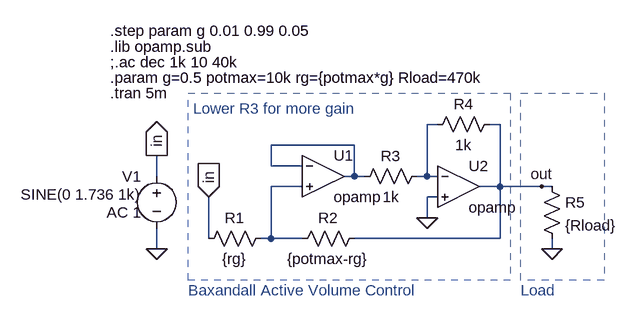
[diagram p0: schematic volume_control.asc]
volume_control.asc, the LTspice schematic file:
Version 4
SHEET 1 1156 680
WIRE 448 -80 432 -80
WIRE 544 -80 528 -80
WIRE 320 -48 192 -48
WIRE 192 -16 192 -48
WIRE 240 -16 192 -16
WIRE 16 0 16 -32
WIRE 320 0 320 -48
WIRE 320 0 304 0
WIRE 336 0 320 0
WIRE 432 0 432 -80
WIRE 432 0 416 0
WIRE 448 0 432 0
WIRE 240 16 192 16
WIRE 544 16 544 -80
WIRE 544 16 512 16
WIRE 608 16 544 16
WIRE 624 16 608 16
WIRE 448 32 432 32
WIRE 432 64 432 32
WIRE 96 96 96 32
WIRE 192 96 192 16
WIRE 192 96 176 96
WIRE 240 96 192 96
WIRE 544 96 544 16
WIRE 544 96 320 96
WIRE 16 112 16 80
WIRE 624 112 624 96
FLAG 16 112 0
FLAG 432 64 0
FLAG 16 -32 in
IOPIN 16 -32 Out
FLAG 96 32 in
IOPIN 96 32 In
FLAG 624 112 0
FLAG 608 16 out
SYMBOL OpAmps\\opamp 272 -64 R0
SYMATTR InstName U1
SYMBOL OpAmps\\opamp 480 -48 R0
SYMATTR InstName U2
SYMBOL res 192 80 R90
WINDOW 0 0 56 VBottom 2
WINDOW 3 32 56 VTop 2
SYMATTR InstName R1
SYMATTR Value {rg}
SYMBOL res 336 80 R90
WINDOW 0 0 56 VBottom 2
WINDOW 3 32 56 VTop 2
SYMATTR InstName R2
SYMATTR Value {potmax-rg}
SYMBOL res 432 -16 R90
WINDOW 0 0 56 VBottom 2
WINDOW 3 32 56 VTop 2
SYMATTR InstName R3
SYMATTR Value 1k
SYMBOL res 544 -96 R90
WINDOW 0 0 56 VBottom 2
WINDOW 3 32 56 VTop 2
SYMATTR InstName R4
SYMATTR Value 1k
SYMBOL res 608 0 R0
SYMATTR InstName R5
SYMATTR Value {Rload}
SYMBOL voltage 16 -16 M0
WINDOW 3 24 44 Left 2
WINDOW 123 24 72 Left 2
WINDOW 39 0 0 Left 0
SYMATTR Value SINE(0 1.736 1k)
SYMATTR Value2 AC 1
SYMATTR InstName V1
TEXT -56 -200 Left 2 !.lib opamp.sub
TEXT -56 -176 Left 2 !;.ac dec 1k 10 40k
TEXT -56 -152 Left 2 !.param g=0.5 potmax=10k rg={potmax*g} Rload=470k
TEXT -56 -128 Left 2 !.tran 5m
TEXT 64 176 Left 2 ;Baxandall Active Volume Control
TEXT 576 176 Left 2 ;Load
TEXT 72 -104 Left 2 ;Lower R3 for more gain
TEXT -56 -224 Left 2 !.step param g 0.01 0.99 0.05
RECTANGLE Normal 704 160 576 -128 1
RECTANGLE Normal 64 -128 560 160 1

The netlist it stands for:
* volume_control.asc
XU1 N002 N003 N002 opamp Aol=100K GBW=10Meg  ; pins invin noninvin out
XU2 N001 0 out opamp Aol=100K GBW=10Meg  ; pins invin noninvin out
R1 N003 in {rg}
R2 out N003 {potmax-rg}
R3 N001 N002 1k
R4 out N001 1k
R5 out 0 {Rload}
V1 in 0 SINE(0 1.736 1k) AC 1
.lib opamp.sub
;.ac dec 1k 10 40k
.param g=0.5 potmax=10k rg={potmax*g} Rload=470k
.tran 5m
* Baxandall Active Volume Control
* Load
* Lower R3 for more gain
.step param g 0.01 0.99 0.05
.backanno
.end